# Altium schematic sheet blockd-env.SchDoc: Block Diagram
size A4; Date: 02/24/22; Author: Edward Kneller; SheetNumber: 2; SheetTotal: 2
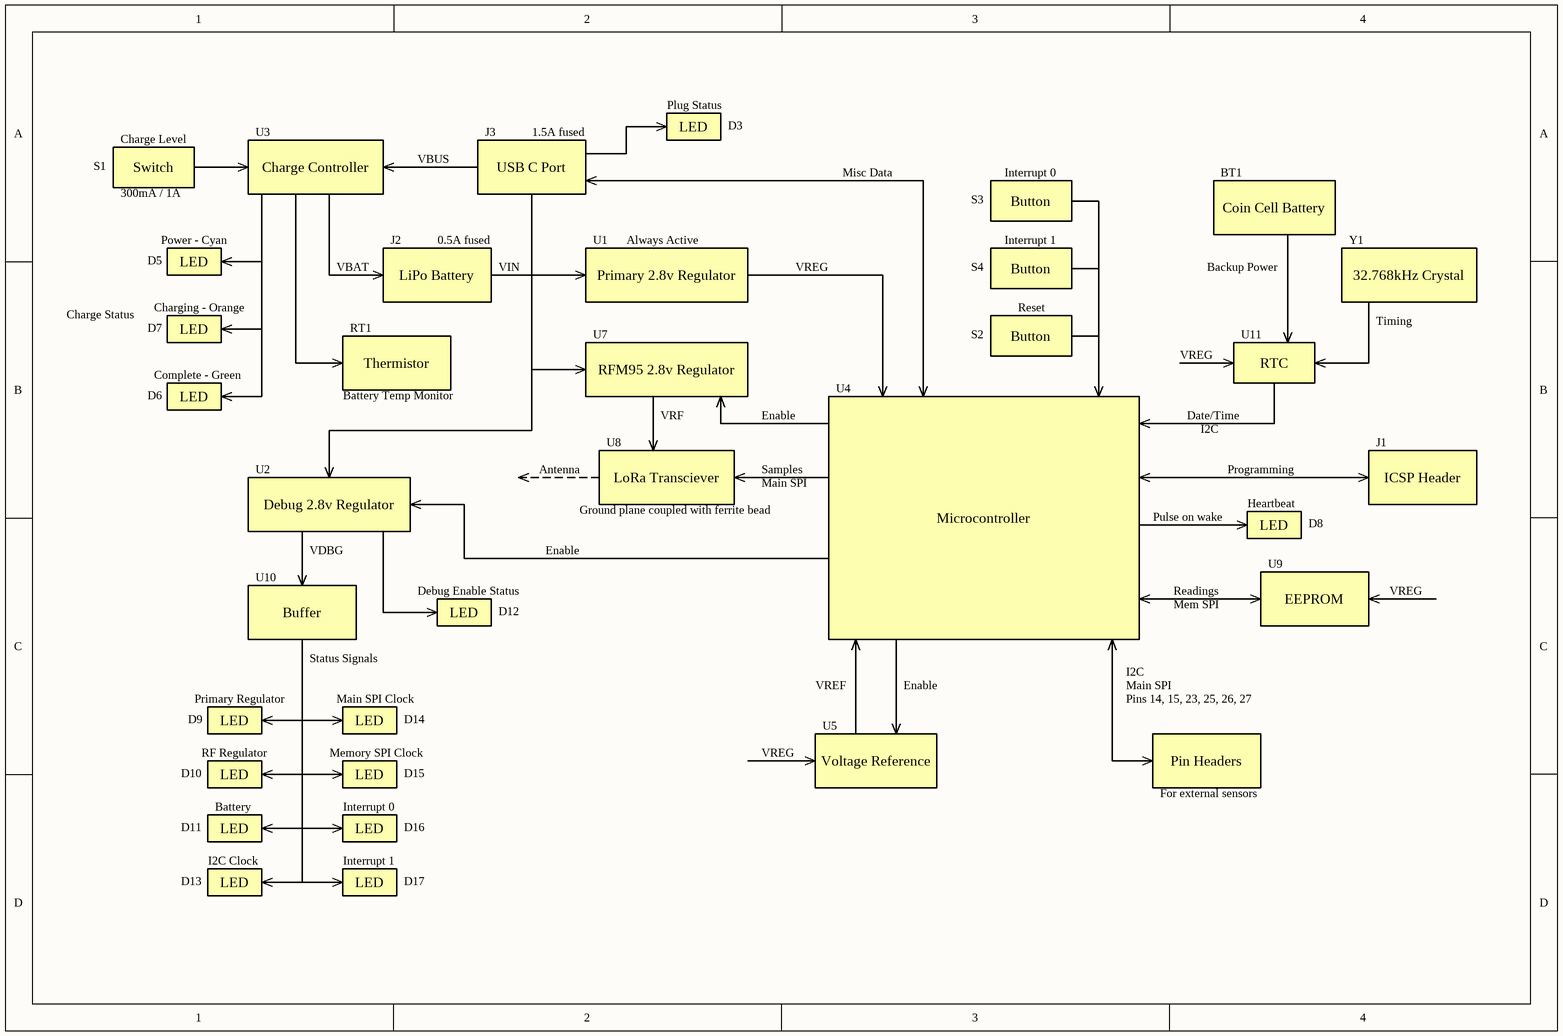
[diagram p0: blockd-env.SchDoc]

## Notes on the sheet
- Plug Status
- S1
- Charge Level
- Switch
- U3
- Charge Controller
- VBUS
- J3
- USB C Port
- 1.5A fused
- LED
- D3
- Misc Data
- Interrupt 0
- BT1
- 300mA / 1A
- Power - Cyan
- J2
- 0.5A fused
- U1
- Always Active
- S3
- Interrupt 1
- Button
- Coin Cell Battery
- Y1
- D5
- Charging - Orange
- VBAT
- LiPo Battery
- VIN
- Primary 2.8v Regulator
- VREG
- S4
- Reset
- Backup Power
- 32.768kHz Crystal
- Charge Status
- D7
- Complete - Green
- RT1
- Thermistor
- U7
- RFM95 2.8v Regulator
- S2
- U11
- RTC
- Timing
- D6
- Battery Temp Monitor
- U8
- VRF
- Enable
- U4
- Date/Time
- I2C
- J1
- U2
- Debug 2.8v Regulator
- Antenna
- Ground plane coupled with ferrite bead
- LoRa Transciever
- Samples
- Main SPI
- Microcontroller
- Pulse on wake
- Programming
- Heartbeat
- ICSP Header
- U10
- VDBG
- U9
- D8
- Buffer
- Debug Enable Status
- D12
- Readings
- Mem SPI
- EEPROM
- Primary Regulator
- Status Signals
- Main SPI Clock
- VREF
- Pins 14, 15, 23, 25, 26, 27
- D10
- D9
- RF Regulator
- Memory SPI Clock
- D14
- D15
- U5
- Voltage Reference
- Pin Headers
- D11
- Battery
- D16
- For external sensors
- D13
- I2C Clock
- D17